# Altium schematic sheet BlockDiagram.SchDoc
size C
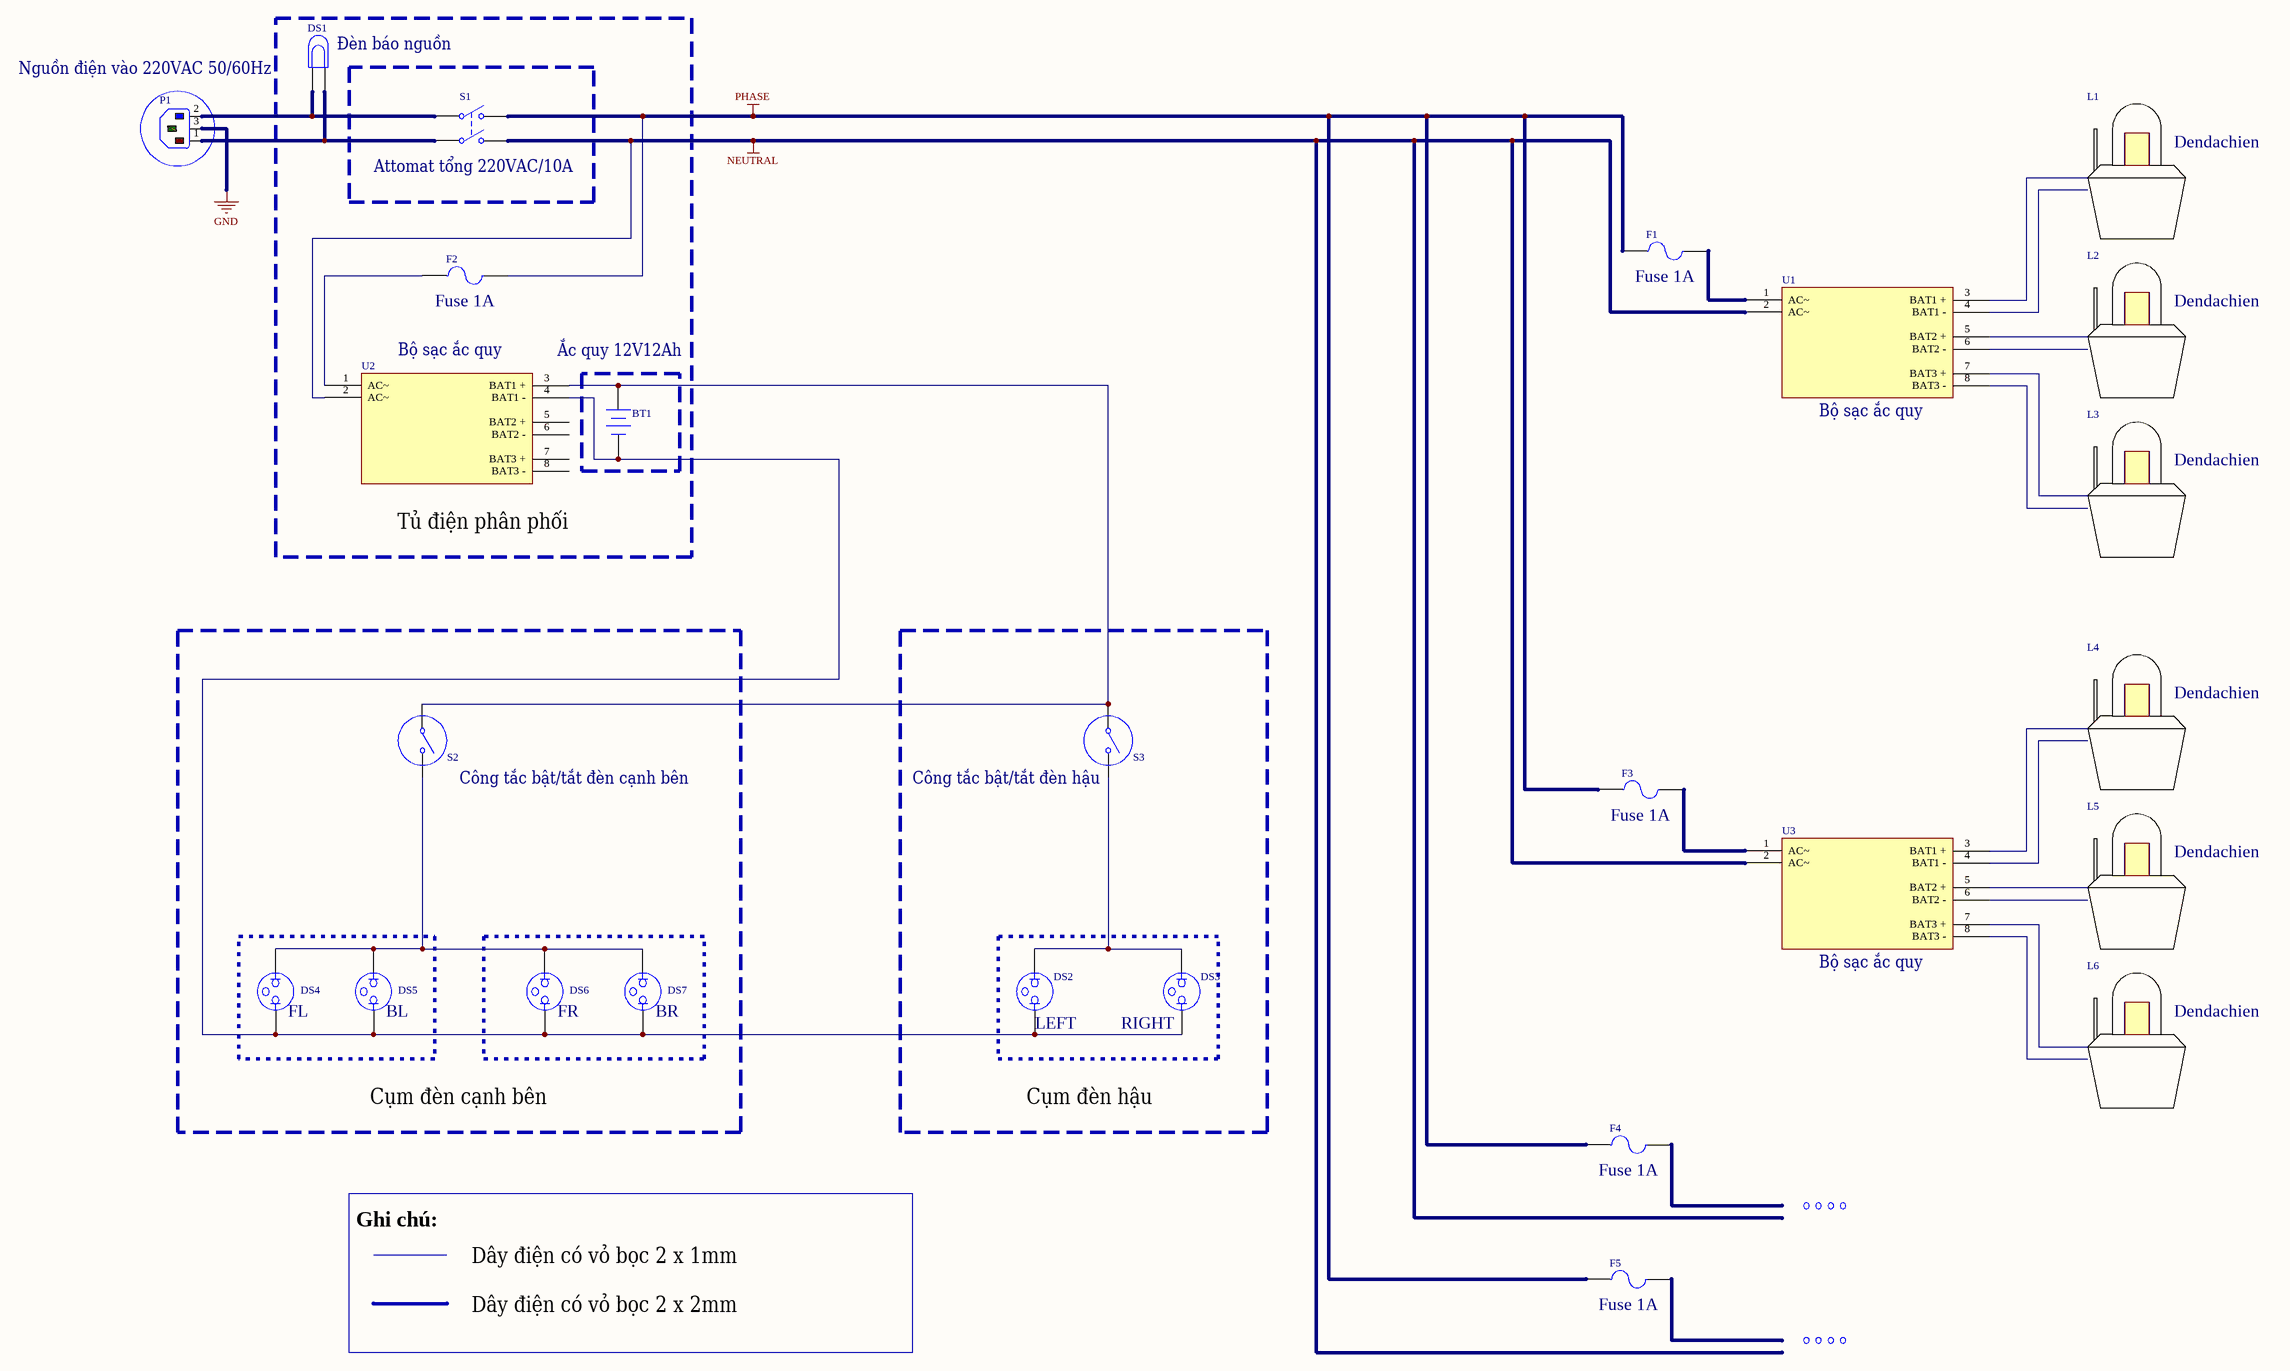
[diagram p0: BlockDiagram.SchDoc]

## Parts
BT1  Ắc quy 12V12Ah  [BAT-2]
DS1  Đèn báo nguồn  [PIN2]
DS2  LEFT  [PIN2]
DS3  RIGHT  [PIN2]
DS4  FL  [PIN2]
DS5  BL  [PIN2]
DS6  FR  [PIN2]
DS7  BR  [PIN2]
F1  Fuse 1A  [PIN-W2/E2.8]
F2  Fuse 1A  [PIN-W2/E2.8]
F3  Fuse 1A  [PIN-W2/E2.8]
F4  Fuse 1A  [PIN-W2/E2.8]
F5  Fuse 1A  [PIN-W2/E2.8]
L1  Dendachien
L2  Dendachien
L3  Dendachien
L4  Dendachien
L5  Dendachien
L6  Dendachien
P1  Nguồn điện vào 220VAC 50/60Hz  [IEC9.14-2H3]
S1  Attomat tổng 220VAC/10A  [DPST-4]
S2  Công tắc bật/tắt đèn cạnh bên  [SPST-2]
S3  Công tắc bật/tắt đèn hậu  [SPST-2]
U1  Bộ sạc ắc quy
U2  Bộ sạc ắc quy
U3  Bộ sạc ắc quy

## Nets
GND: P1.3(E)
NEUTRAL: S1.4(NO2) U1.2(AC~) U2.2(AC~) U3.2(AC~)
PHASE: F1.1 F2.2 F3.1 F4.1 F5.1 S1.2(NO1)
NetBT1_1: BT1.1(+) S2.1(COMMON) S3.1(COMMON) U2.3(BAT1_+)
NetBT1_2: BT1.2(-) DS2.1 DS3.1 DS4.1 DS5.1 DS6.1 DS7.1 U2.4(BAT1_-)
NetDS1_1: DS1.1 P1.2(N) S1.1(COMMON1)
NetDS1_2: DS1.2 P1.1(L) S1.3(COMMON2)
NetDS2_2: DS2.2 DS3.2 S3.2(NO)
NetDS4_2: DS4.2 DS5.2 DS6.2 DS7.2 S2.2(NO)
NetF1_2: F1.2 U1.1(AC~)
NetF2_1: F2.1 U2.1(AC~)
NetF3_2: F3.2 U3.1(AC~)

Not connected (* = marked no-connect by the designer): F4 2; F5 2; U1 3(BAT1_+) 4(BAT1_-) 5(BAT2_+) 6(BAT2_-) 7(BAT3_+) 8(BAT3_-); U2 5(BAT2_+) 6(BAT2_-) 7(BAT3_+) 8(BAT3_-); U3 3(BAT1_+) 4(BAT1_-) 5(BAT2_+) 6(BAT2_-) 7(BAT3_+) 8(BAT3_-)

## Notes on the sheet
- (near U2) Tủ điện phân phối
- Cụm đèn cạnh bên
- Cụm đèn hậu
- Ghi chú:
- Dây điện có vỏ bọc 2 x 1mm
- Dây điện có vỏ bọc 2 x 2mm

## Library data of the parts
BT1 = Battery: Multicell Battery; Published: 24-Mar-1999; LatestRevisionDate: 17-Jul-2002; LatestRevisionNote: Re-released for DXP Platform.; PackageReference: BAT-2; Publisher: Altium Limited; PackageDescription: Battery; 2 Leads
DS1 = Lamp: Incandescent Bulb; Published: 24-Mar-1999; LatestRevisionDate: 17-Jul-2002; LatestRevisionNote: Re-released for DXP Platform.; PackageReference: PIN2; Publisher: Altium Limited
DS2-DS7 = Lamp Neon: Neon Lamp; Published: 24-Mar-1999; LatestRevisionDate: 17-Jul-2002; LatestRevisionNote: Re-released for DXP Platform.; PackageReference: PIN2; Publisher: Altium Limited
F1-F5 = Fuse 2: Fuse; Published: 8-Jun-2000; LatestRevisionDate: 17-Jul-2002; LatestRevisionNote: Re-released for DXP Platform.; PackageReference: PIN-W2/E2.8; Publisher: Altium Limited; PackageDescription: Thru-Hole; 2 Leads
P1 = Plug AC Male: IEC Mains Power Inlet, EN60 320-1 C14 Class I Cold Condition, PC Flange Rear Mount, Chassis Plug; PackageDocument: ver.80, 15-Sep-2003; MaximumRating: 10A, 250V a.c. (UL & CSA 15A, 250V a.c.); MountingFixtures: Not drawn on schematic symbol.; PCB_Layout: Complies with manufacturer's recommendation.; DrillSize: Corresponds to nominal value.; Note: IEC Color Scheme employed for L, N and E.; Published: 15-Jul-2004; LatestRevisionDate: 15-Jul-2004; LatestRevisionNote: Component Replaced.; DatasheetDocument: ver.80, 15-Sep-2003; PackageReference: PX0580/PC; Publisher: Altium Limited; Terminations: P.C. Spills; ComponentLink1Description: Manufacturer Link; ComponentLink1URL: http://www.bulgin.co.uk/
S1 = SW-DPST: Double-Pole, Single-Throw Switch; Published: 24-Mar-1999; LatestRevisionDate: 17-Jul-2002; LatestRevisionNote: Re-released for DXP Platform.; PackageReference: DPST-4; Publisher: Altium Limited; PackageDescription: Switch; 4 Leads
S2 S3 = SW-SPST: Single-Pole, Single-Throw Switch; Published: 24-Mar-1999; LatestRevisionDate: 17-Jul-2002; LatestRevisionNote: Re-released for DXP Platform.; PackageReference: SPST-2; Publisher: Altium Limited; PackageDescription: Switch; 2 Leads
U1-U3 = Bosacacquy